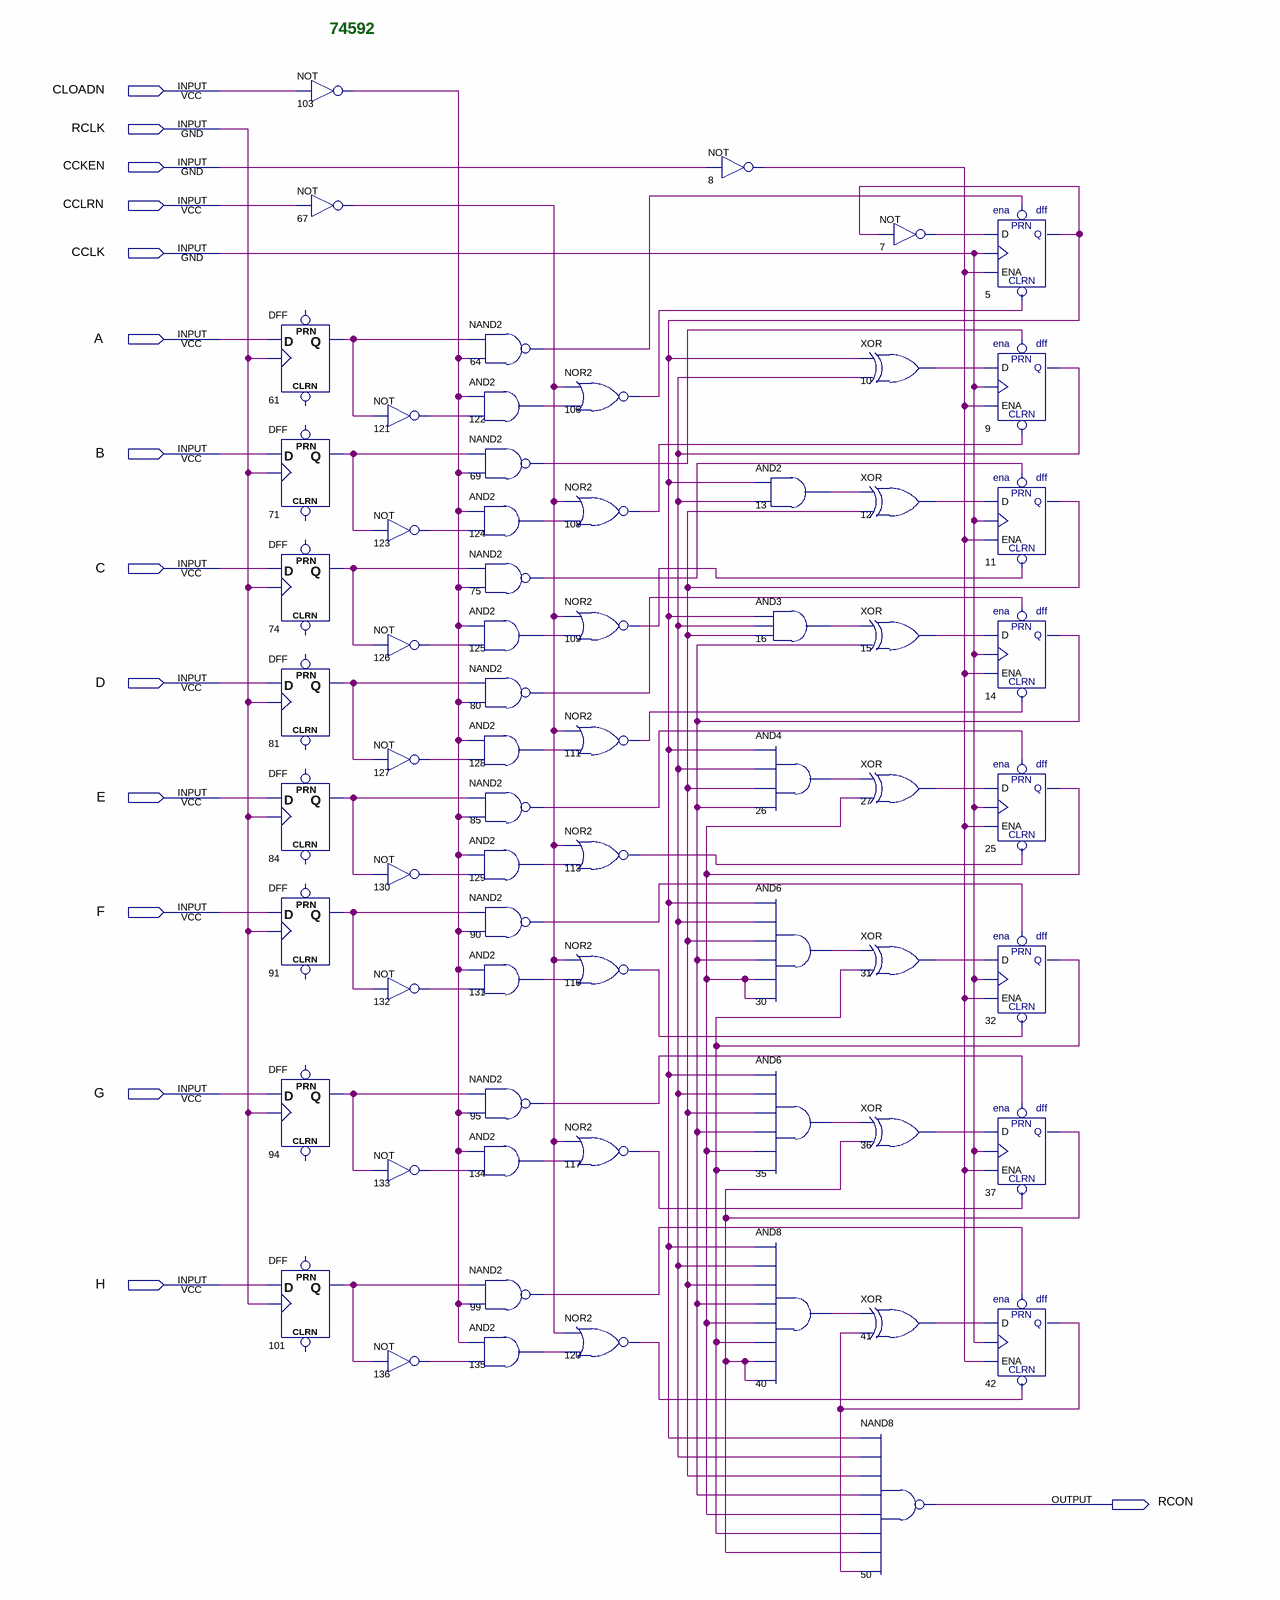
[diagram p0: schematic sheet]
// Quartus schematic 74592.bdf as structural Verilog: 66 symbols, 14 pins
module \74592  (
  input  CLOADN,
  input  RCLK,
  input  CCKEN,
  input  CCLRN,
  input  CCLK,
  input  A,
  input  B,
  input  C,
  input  D,
  input  E,
  input  F,
  input  G,
  input  H,
  output RCON
);

  wire n5_q, n7_out, n8_out, n9_q, n10_out, n11_q, n12_out, n13_out, n14_q, n15_out, n16_out, n25_q, n26_out,
       n27_out, n30_out, n31_out, n32_q, n35_out, n36_out, n37_q, n40_out, n41_out, n42_q, n61_q, n64_out,
       n67_out, n69_out, n71_q, n74_q, n75_out, n80_out, n81_q, n84_q, n85_out, n90_out, n91_q, n94_q,
       n95_out, n99_out, n101_q, n103_out, n106_out, n108_out, n109_out, n111_out, n113_out, n116_out,
       n117_out, n120_out, n121_out, n122_out, n123_out, n124_out, n125_out, n126_out, n127_out, n128_out,
       n129_out, n130_out, n131_out, n132_out, n133_out, n134_out, n135_out, n136_out;

  DFF u_61 (.CLK(RCLK), .D(A), .Q(n61_q));  // open: CLRN, PRN
  DFF u_71 (.CLK(RCLK), .D(B), .Q(n71_q));  // open: CLRN, PRN
  DFF u_74 (.CLK(RCLK), .D(C), .Q(n74_q));  // open: CLRN, PRN
  DFF u_81 (.CLK(RCLK), .D(D), .Q(n81_q));  // open: CLRN, PRN
  DFF u_84 (.CLK(RCLK), .D(E), .Q(n84_q));  // open: CLRN, PRN
  DFF u_91 (.CLK(RCLK), .D(F), .Q(n91_q));  // open: CLRN, PRN
  DFF u_94 (.CLK(RCLK), .D(G), .Q(n94_q));  // open: CLRN, PRN
  DFF u_101 (.CLK(RCLK), .D(H), .Q(n101_q));  // open: CLRN, PRN
  not u_103 (n103_out, CLOADN);
  not u_67 (n67_out, CCLRN);
  not u_121 (n121_out, n61_q);
  not u_123 (n123_out, n71_q);
  not u_126 (n126_out, n74_q);
  not u_127 (n127_out, n81_q);
  not u_130 (n130_out, n84_q);
  not u_132 (n132_out, n91_q);
  not u_133 (n133_out, n94_q);
  not u_136 (n136_out, n101_q);
  nand u_64 (n64_out, n61_q, n103_out);
  and u_122 (n122_out, n103_out, n121_out);
  nand u_69 (n69_out, n71_q, n103_out);
  and u_124 (n124_out, n103_out, n123_out);
  nand u_75 (n75_out, n74_q, n103_out);
  and u_125 (n125_out, n103_out, n126_out);
  nand u_80 (n80_out, n81_q, n103_out);
  and u_128 (n128_out, n103_out, n127_out);
  nand u_85 (n85_out, n84_q, n103_out);
  and u_129 (n129_out, n103_out, n130_out);
  nand u_90 (n90_out, n91_q, n103_out);
  and u_131 (n131_out, n103_out, n132_out);
  nand u_95 (n95_out, n94_q, n103_out);
  and u_134 (n134_out, n103_out, n133_out);
  nand u_99 (n99_out, n101_q, n103_out);
  and u_135 (n135_out, n103_out, n136_out);
  nor u_106 (n106_out, n67_out, n122_out);
  nor u_108 (n108_out, n67_out, n124_out);
  nor u_109 (n109_out, n67_out, n125_out);
  nor u_111 (n111_out, n67_out, n128_out);
  nor u_113 (n113_out, n67_out, n129_out);
  nor u_116 (n116_out, n67_out, n131_out);
  nor u_117 (n117_out, n67_out, n134_out);
  nor u_120 (n120_out, n67_out, n135_out);
  not u_8 (n8_out, CCKEN);
  and u_13 (n13_out, n5_q, n9_q);
  and u_16 (n16_out, n5_q, n9_q, n11_q);
  and u_26 (n26_out, n5_q, n9_q, n11_q, n14_q);
  and u_30 (n30_out, n5_q, n9_q, n11_q, n14_q, n25_q, n25_q);
  and u_35 (n35_out, n5_q, n9_q, n11_q, n14_q, n25_q, n32_q);
  and u_40 (n40_out, n5_q, n9_q, n11_q, n14_q, n25_q, n32_q, n37_q, n37_q);
  not u_7 (n7_out, n5_q);
  xor u_10 (n10_out, n5_q, n9_q);
  xor u_12 (n12_out, n13_out, n11_q);
  xor u_15 (n15_out, n16_out, n14_q);
  xor u_27 (n27_out, n26_out, n25_q);
  xor u_31 (n31_out, n30_out, n32_q);
  xor u_36 (n36_out, n35_out, n37_q);
  xor u_41 (n41_out, n40_out, n42_q);
  nand u_50 (RCON, n5_q, n9_q, n11_q, n14_q, n25_q, n32_q, n37_q, n42_q);
  enadff u_5 (.ENA(n8_out), .D(n7_out), .PRN(n64_out), .CLRN(n106_out), .CLK(CCLK), .Q(n5_q));
  enadff u_9 (.ENA(n8_out), .D(n10_out), .PRN(n69_out), .CLRN(n108_out), .CLK(CCLK), .Q(n9_q));
  enadff u_11 (.ENA(n8_out), .D(n12_out), .PRN(n75_out), .CLRN(n109_out), .CLK(CCLK), .Q(n11_q));
  enadff u_14 (.ENA(n8_out), .D(n15_out), .PRN(n80_out), .CLRN(n111_out), .CLK(CCLK), .Q(n14_q));
  enadff u_25 (.ENA(n8_out), .D(n27_out), .PRN(n85_out), .CLRN(n113_out), .CLK(CCLK), .Q(n25_q));
  enadff u_32 (.ENA(n8_out), .D(n31_out), .PRN(n90_out), .CLRN(n116_out), .CLK(CCLK), .Q(n32_q));
  enadff u_37 (.ENA(n8_out), .D(n36_out), .PRN(n95_out), .CLRN(n117_out), .CLK(CCLK), .Q(n37_q));
  enadff u_42 (.ENA(n8_out), .D(n41_out), .PRN(n99_out), .CLRN(n120_out), .CLK(CCLK), .Q(n42_q));

  // Notes on the sheet:
  //   74592
endmodule
